# Altium schematic sheet pic.SchDoc
size A4
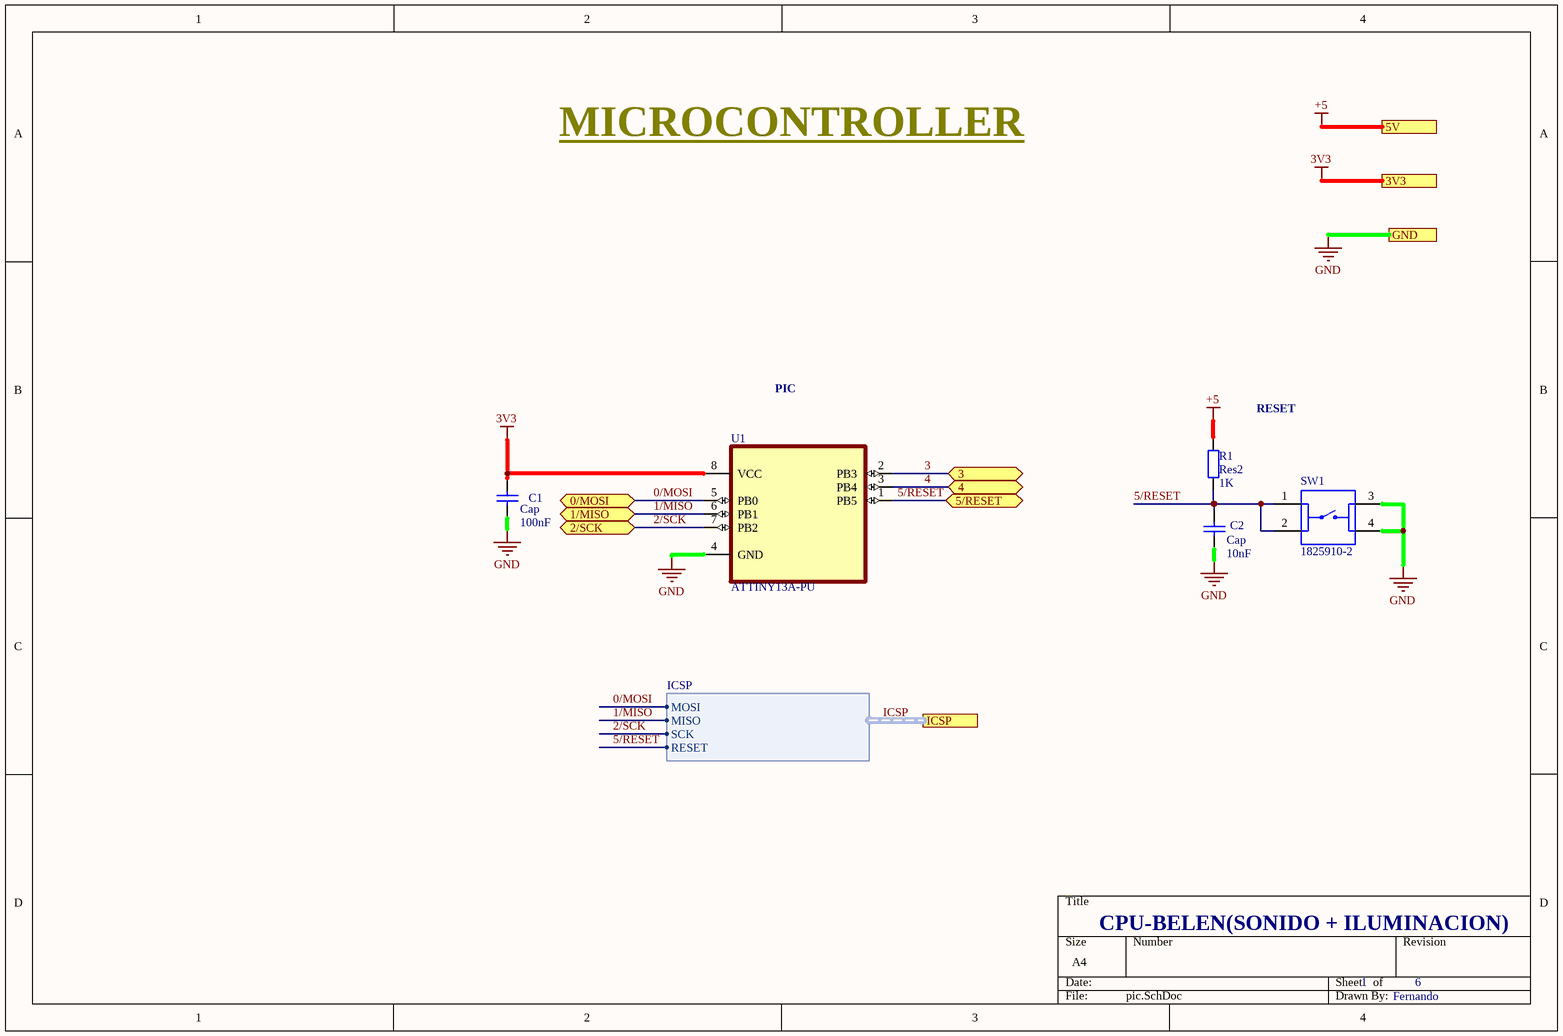
[diagram p0: pic.SchDoc]

## Parts
C1  Cap  value 100nF  [RAD-0.3]
C2  Cap  value 10nF  [RAD-0.3]
R1  Res2  value 1K  [AXIAL-0.4]
SW1  1825910-2  [TE_1825910-2]
U1  ATTINY13A-PU  [DIP254P762X533-8]

## Ports
0/MOSI (bidir), 1/MISO (bidir), 2/SCK (bidir), 3 (bidir), 3V3, 4 (bidir), 5/RESET (bidir), 5V, GND, ICSP (harness ICSP)

## Harnesses
ICSP: MOSI, MISO, SCK, RESET

## Nets
3V3: C1.2 U1.8(VCC) ; port 3V3
+5: R1.2 ; port 5V
GND: C1.1 C2.1 SW1.3 SW1.4 U1.4(GND) ; port GND
0/MOSI: U1.5(PB0) ; port 0/MOSI, port ICSP.MOSI
1/MISO: U1.6(PB1) ; port 1/MISO, port ICSP.MISO
2/SCK: U1.7(PB2) ; port 2/SCK, port ICSP.SCK
3: U1.2(PB3) ; port 3
4: U1.3(PB4) ; port 4
5/RESET: C2.2 R1.1 SW1.1 SW1.2 U1.1(PB5) ; port 5/RESET, port ICSP.RESET

## Buses and harness runs
harness ICSP = port ICSP

## Notes on the sheet
- MICROCONTROLLER
- PIC
- RESET
- CPU-BELEN(SONIDO + ILUMINACION)
- 1
- 6
- Fernando

## Library data of the parts
C1 C2 = Cap: Capacitor; Published: 8-Jun-2000; LatestRevisionDate: 17-Jul-2002; LatestRevisionNote: Re-released for DXP Platform.; PackageReference: RAD-0.3; Publisher: Altium Limited; PackageDescription: Radial Cap, Thru-Hole; 2 Leads; 0.3 in Pin Spacing
R1 = Res2: Resistor; Published: 8-Jun-2000; LatestRevisionDate: 17-Jul-2002; LatestRevisionNote: Re-released for DXP Platform.; PackageReference: AXIAL-0.4; Publisher: Altium Limited; PackageDescription: Axial Device, Thru-Hole; 2 Leads; 0.4 in Pin Spacing
SW1 = 1825910-2: 50 mA SPST Round Actuator 160 Gram Force Tactile Pushbutton Switch; Contact_Current_Rating: 50 mA; MF: TE Connectivity; Configuration_Pole-Throw: Single Pole - Single Throw; Availability: Unavailable; MP: 1825910-2; Value: *; Package: None; SnapEDA_Link: https://www.snapeda.com/parts/1825910-2/TE%20Connectivity%20ALCOSWITCH%20Switches/view-part/278983/?ref=snap; TE_purchase_URL: https://www.te.com/usa-en/product-1825910-2.html?te_bu=Cor&te_type=disp&te_campaign=seda_glo_cor-seda-global-disp-prtnr-fy19-seda-model-bom-cta_sma-317_1&elqCampaignId=32493; EU_RoHS_Compliance: Compliant; Price: None
U1 = ATTINY13A-PU: AVR AVRÂ® ATtiny Microcontroller IC 8-Bit 20MHz 1KB _512 x 16_ FLASH 8-PDIP; MF: Microchip; Availability: Unavailable; SnapEDA_Link: https://www.snapeda.com/parts/ATTINY13A-PU/Microchip/view-part/668134/?ref=snap; Value: *; Price: None; Package: PDIP-8 Microchip; MP: ATTINY13A-PU